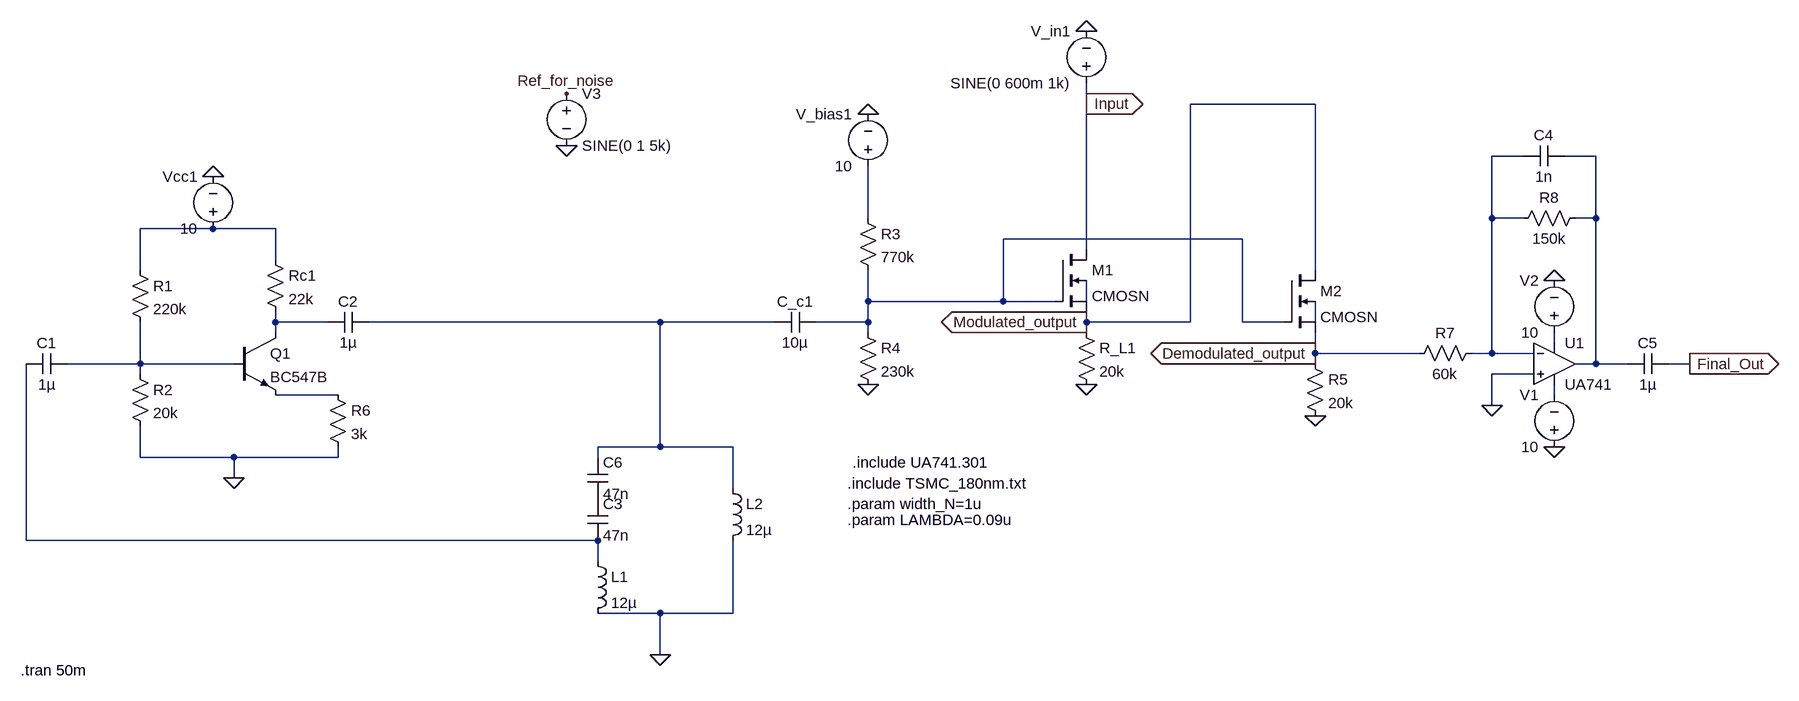
[diagram p0: schematic Full_Circuit.asc]
Full_Circuit.asc, the LTspice schematic file:
Version 4
SHEET 1 3336 680
WIRE 1184 -384 1184 -416
WIRE 1536 -384 1344 -384
WIRE 1856 -304 1808 -304
WIRE 1968 -304 1920 -304
WIRE 848 -208 848 -288
WIRE 1808 -208 1808 -304
WIRE 1856 -208 1808 -208
WIRE 1968 -208 1968 -304
WIRE 1968 -208 1936 -208
WIRE -160 -192 -272 -192
WIRE -64 -192 -160 -192
WIRE 1424 -176 1056 -176
WIRE 1184 -160 1184 -384
WIRE -64 -144 -64 -192
WIRE -272 -128 -272 -192
WIRE 1536 -128 1536 -384
WIRE 848 -80 848 -128
WIRE 1056 -80 1056 -176
WIRE 1056 -80 848 -80
WIRE 1136 -80 1056 -80
WIRE 1184 -80 1184 -112
WIRE -64 -48 -64 -64
WIRE 16 -48 -64 -48
WIRE 528 -48 80 -48
WIRE 704 -48 528 -48
WIRE 848 -48 848 -80
WIRE 848 -48 768 -48
WIRE 1184 -48 1184 -64
WIRE 1344 -48 1344 -384
WIRE 1344 -48 1184 -48
WIRE 1424 -48 1424 -176
WIRE 1488 -48 1424 -48
WIRE 1536 -48 1536 -80
WIRE -64 -32 -64 -48
WIRE 848 -32 848 -48
WIRE 1184 -32 1184 -48
WIRE 1904 -16 1904 -32
WIRE 1536 0 1536 -32
WIRE 1696 0 1536 0
WIRE 1808 0 1808 -208
WIRE 1808 0 1776 0
WIRE 1872 0 1808 0
WIRE -272 16 -272 -48
WIRE -272 16 -384 16
WIRE -128 16 -272 16
WIRE 1536 16 1536 0
WIRE 1968 16 1968 -208
WIRE 1968 16 1936 16
WIRE 2016 16 1968 16
WIRE 2112 16 2080 16
WIRE -272 32 -272 16
WIRE 1872 32 1808 32
WIRE 32 64 -64 64
WIRE 1904 64 1904 48
WIRE 1808 80 1808 32
WIRE 528 144 528 -48
WIRE 528 144 432 144
WIRE 640 144 528 144
WIRE -272 160 -272 112
WIRE -128 160 -272 160
WIRE 32 160 32 144
WIRE 32 160 -128 160
WIRE 432 160 432 144
WIRE -128 192 -128 160
WIRE 640 208 640 144
WIRE -448 288 -448 16
WIRE 432 288 -448 288
WIRE 432 320 432 288
WIRE 528 400 432 400
WIRE 640 400 640 288
WIRE 640 400 528 400
WIRE 528 464 528 400
FLAG 848 48 0
FLAG 848 -368 0
FLAG 1184 -496 0
FLAG 1184 48 0
FLAG 1536 96 0
FLAG 1904 144 0
FLAG 1904 -112 0
FLAG 1184 -384 Input
IOPIN 1184 -384 Out
FLAG 1184 -48 Modulated_output
IOPIN 1184 -48 Out
FLAG 2112 16 Final_Out
IOPIN 2112 16 Out
FLAG 1536 0 Demodulated_output
IOPIN 1536 0 Out
FLAG 1808 80 0
FLAG 528 464 0
FLAG -128 192 0
FLAG -160 -272 0
FLAG 384 -320 0
FLAG 384 -400 Ref_for_noise
DATAFLAG 1184 -192 ""
DATAFLAG 1040 -80 ""
DATAFLAG 1216 -48 ""
DATAFLAG 1632 0 ""
DATAFLAG 1536 -160 ""
SYMBOL nmos4 1136 -160 R0
SYMATTR InstName M1
SYMATTR Value CMOSN
SYMATTR Value2 l={2*LAMBDA} w={width_N} ad={5*width_ N*LAMBDA} as={5*width_ N*LAMBDA} pd={10*LAMBDA+2*width_N} ps={10*LAMBDA+2*width_N}
SYMBOL res 832 -224 R0
SYMATTR InstName R3
SYMATTR Value 770k
SYMBOL res 832 -48 R0
SYMATTR InstName R4
SYMATTR Value 230k
SYMBOL cap 768 -64 R90
WINDOW 0 0 32 VBottom 2
WINDOW 3 32 32 VTop 2
SYMATTR InstName C_c1
SYMATTR Value 10µ
SYMBOL voltage 848 -272 R180
WINDOW 0 24 96 Left 2
WINDOW 3 24 16 Left 2
SYMATTR InstName V_bias1
SYMATTR Value 10
SYMBOL voltage 1184 -400 R180
WINDOW 0 24 96 Left 2
WINDOW 3 24 16 Left 2
WINDOW 123 0 0 Left 0
WINDOW 39 0 0 Left 0
SYMATTR InstName V_in1
SYMATTR Value SINE(0 600m 1k)
SYMBOL res 1168 -48 R0
SYMATTR InstName R_L1
SYMATTR Value 20k
SYMBOL nmos4 1488 -128 R0
SYMATTR InstName M2
SYMATTR Value CMOSN
SYMATTR Value2 l={2*LAMBDA} w={width_N} ad={5*width_ N*LAMBDA} as={5*width_ N*LAMBDA} pd={10*LAMBDA+2*width_N} ps={10*LAMBDA+2*width_N}
SYMBOL res 1520 0 R0
SYMATTR InstName R5
SYMATTR Value 20k
SYMBOL OpAmps\\opamp2 1904 -48 R0
SYMATTR InstName U1
SYMATTR Value UA741
SYMBOL voltage 1904 160 R180
WINDOW 0 24 96 Left 2
WINDOW 3 24 16 Left 2
WINDOW 123 0 0 Left 0
WINDOW 39 0 0 Left 0
SYMATTR InstName V1
SYMATTR Value 10
SYMBOL voltage 1904 -16 R180
WINDOW 0 24 96 Left 2
WINDOW 3 24 16 Left 2
WINDOW 123 0 0 Left 0
WINDOW 39 0 0 Left 0
SYMATTR InstName V2
SYMATTR Value 10
SYMBOL res 1792 -16 R90
WINDOW 0 0 56 VBottom 2
WINDOW 3 32 56 VTop 2
SYMATTR InstName R7
SYMATTR Value 60k
SYMBOL res 1952 -224 R90
WINDOW 0 0 56 VBottom 2
WINDOW 3 32 56 VTop 2
SYMATTR InstName R8
SYMATTR Value 150k
SYMBOL cap 1920 -320 R90
WINDOW 0 0 32 VBottom 2
WINDOW 3 32 32 VTop 2
SYMATTR InstName C4
SYMATTR Value 1n
SYMBOL cap 2080 0 R90
WINDOW 0 0 32 VBottom 2
WINDOW 3 32 32 VTop 2
SYMATTR InstName C5
SYMATTR Value 1µ
SYMBOL ind 416 304 R0
SYMATTR InstName L1
SYMATTR Value 12µ
SYMBOL ind 624 192 R0
SYMATTR InstName L2
SYMATTR Value 12µ
SYMBOL voltage -160 -176 R180
WINDOW 0 24 96 Left 2
WINDOW 3 24 16 Left 2
WINDOW 123 0 0 Left 0
WINDOW 39 0 0 Left 0
SYMATTR InstName Vcc1
SYMATTR Value 10
SYMBOL res -288 -144 R0
SYMATTR InstName R1
SYMATTR Value 220k
SYMBOL res -80 -160 R0
SYMATTR InstName Rc1
SYMATTR Value 22k
SYMBOL res -288 16 R0
SYMATTR InstName R2
SYMATTR Value 20k
SYMBOL npn -128 -32 R0
SYMATTR InstName Q1
SYMATTR Value BC547B
SYMBOL cap -384 0 R90
WINDOW 0 0 32 VBottom 2
WINDOW 3 32 32 VTop 2
SYMATTR InstName C1
SYMATTR Value 1µ
SYMBOL cap 80 -64 R90
WINDOW 0 0 32 VBottom 2
WINDOW 3 32 32 VTop 2
SYMATTR InstName C2
SYMATTR Value 1µ
SYMBOL res 16 48 R0
SYMATTR InstName R6
SYMATTR Value 3k
SYMBOL cap 416 224 R0
SYMATTR InstName C3
SYMATTR Value 47n
SYMBOL cap 416 160 R0
SYMATTR InstName C6
SYMATTR Value 47n
SYMBOL voltage 384 -416 R0
WINDOW 123 0 0 Left 0
WINDOW 39 0 0 Left 0
SYMATTR InstName V3
SYMATTR Value SINE(0 1 5k)
TEXT 816 200 Left 2 !.include TSMC_180nm.txt
TEXT 816 232 Left 2 !.param width_N=1u
TEXT 816 256 Left 2 !.param LAMBDA=0.09u
TEXT 824 168 Left 2 !.include UA741.301
TEXT -456 488 Left 2 !.tran 50m

The netlist it stands for:
* Full_Circuit.asc
M1 Input N005 Modulated_output N006 CMOSN l={2*LAMBDA} w={width_N} ad={5*width_ N*LAMBDA} as={5*width_ N*LAMBDA} pd={10*LAMBDA+2*width_N} ps={10*LAMBDA+2*width_N}
R3 N003 N005 770k
R4 N005 0 230k
C_c1 N005 N008 10µ
V_bias1 N003 0 10
V_in1 Input 0 SINE(0 600m 1k)
R_L1 Modulated_output 0 20k
M2 Modulated_output N005 Demodulated_output N009 CMOSN l={2*LAMBDA} w={width_N} ad={5*width_ N*LAMBDA} as={5*width_ N*LAMBDA} pd={10*LAMBDA+2*width_N} ps={10*LAMBDA+2*width_N}
R5 Demodulated_output 0 20k
XU1 0 N001 N010 N013 N002 UA741  ; pins In+ In- V+ V- OUT
V1 0 N013 10
V2 N010 0 10
R7 N001 Demodulated_output 60k
R8 N002 N001 150k
C4 N002 N001 1n
C5 Final_Out N002 1µ
L1 N014 0 12µ
L2 N008 0 12µ
Vcc1 N004 0 10
R1 N004 N011 220k
Rc1 N004 N007 22k
R2 N011 0 20k
Q1 N007 N011 N012 0 BC547B
C1 N011 N014 1µ
C2 N008 N007 1µ
R6 N012 0 3k
C3 P001 N014 47n
C6 N008 P001 47n
V3 Ref_for_noise 0 SINE(0 1 5k)
.model NPN NPN
.model PNP PNP
.lib standard.bjt
.model NMOS NMOS
.model PMOS PMOS
.lib standard.mos
.include TSMC_180nm.txt
.param width_N=1u
.param LAMBDA=0.09u
.include UA741.301
.tran 50m
.backanno
.end